# Altium project MAIN BOARD CERES.PrjPcb (part 1 of 2)
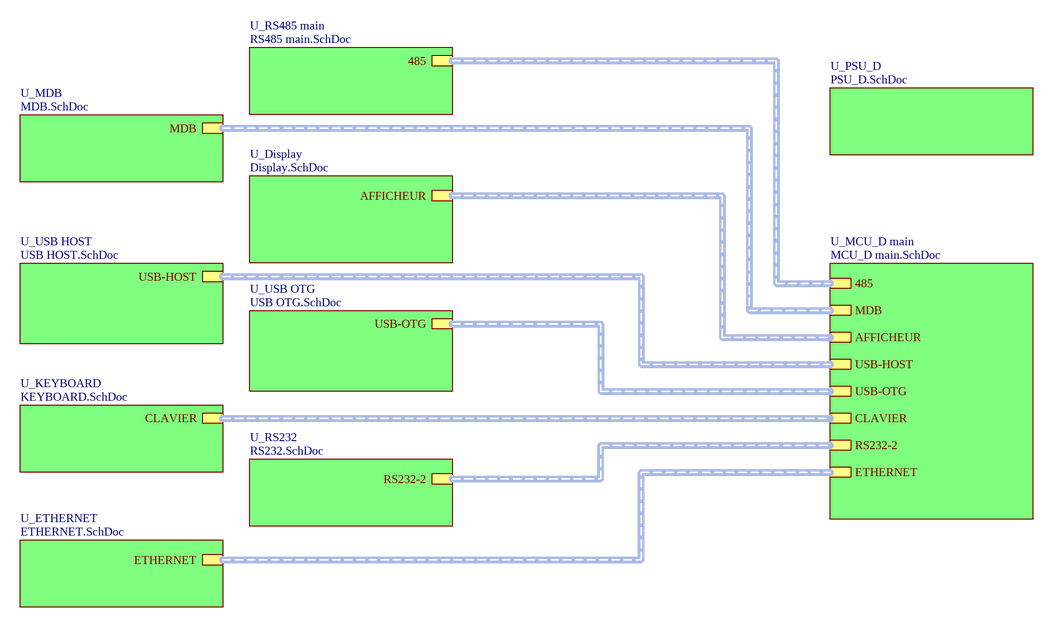
[diagram p0: TOPSHEET.SchDoc]
DrawnBy: Rachid AKKOUCHE; Telephone: +33651604047
10 sheets, 146 parts. Net scope: hierarchical (ports join the sheet entries above them; power ports are global).
Board file: MAIN BOARD CERESV2-2-3.PCBDOC
Sheets:
  TOPSHEET.SchDoc
    U_RS485 main = RS485 main.SchDoc
    U_MDB = MDB.SchDoc
    U_KEYBOARD = KEYBOARD.SchDoc
    U_USB HOST = USB HOST.SchDoc
    U_USB OTG = USB OTG.SchDoc
    U_Display = Display.SchDoc
    U_RS232 = RS232.SchDoc
    U_ETHERNET = ETHERNET.SchDoc
    U_PSU_D = PSU_D.SchDoc

## Sheet TOPSHEET.SchDoc: TOP SHEET
size A4; Date: 30 08 2013; Author: Rachid AKKOUCHE; CompanyName: RASoftware; Organization: RASoftware; Address1: 52 J03, rue de la crèche; Address2: 77100 MEAUX; Address3: FRANCE; DocumentNumber: BRA201308301C; Revision: C; SheetNumber: 1; SheetTotal: 11; Telephone: +33651604047; Email: rachid.akkouche@wanadoo.fr; Proprietaire: MDI; Dessinepar: Rachid AKKOUCHE; Verifiepar: -; Time: 19:00

### Sub-sheets
U_Display = Display.SchDoc: AFFICHEUR (harness IO DISPLAY)
U_ETHERNET = ETHERNET.SchDoc: ETHERNET (harness ETHERNET)
U_KEYBOARD = KEYBOARD.SchDoc: CLAVIER (harness KEYBOARD)
U_MCU_D main = MCU_D main.SchDoc (file not in this document): USB-HOST (harness USB-HOST), USB-OTG (harness USG-OTG), RS232-2 (harness RS232_2), ETHERNET (harness ETHERNET), AFFICHEUR (harness IO DISPLAY), CLAVIER (harness KEYBOARD), 485 (harness EIA-485), MDB (harness MDB)
U_MDB = MDB.SchDoc: MDB (harness MDB)
U_PSU_D = PSU_D.SchDoc: no entries
U_RS232 = RS232.SchDoc: RS232-2 (harness RS232_2)
U_RS485 main = RS485 main.SchDoc: 485 (harness EIA-485)
U_USB HOST = USB HOST.SchDoc: USB-HOST (harness USB-HOST)
U_USB OTG = USB OTG.SchDoc: USB-OTG (harness USG-OTG)

### Buses and harness runs
harness sheet U_Display/AFFICHEUR = sheet U_MCU_D main/AFFICHEUR
harness sheet U_ETHERNET/ETHERNET = sheet U_MCU_D main/ETHERNET
harness sheet U_KEYBOARD/CLAVIER = sheet U_MCU_D main/CLAVIER
harness sheet U_MCU_D main/485 = sheet U_RS485 main/485
harness sheet U_MCU_D main/MDB = sheet U_MDB/MDB
harness sheet U_MCU_D main/RS232-2 = sheet U_RS232/RS232-2
harness sheet U_MCU_D main/USB-HOST = sheet U_USB HOST/USB-HOST
harness sheet U_MCU_D main/USB-OTG = sheet U_USB OTG/USB-OTG

### Notes on the sheet
- Ce document est la propriété de
- Project:
- Il ne peut être divulgué sans l'accord écrit de l'un de ses représentants dûment mandaté
- Title:
- Number:
- Date:
- Time:
- Size:
- A4
- Revision:
- Sheet
- of
- 52 J03 rue de la crèche
- Draw by:
- 77100 Meaux

## Sheet RS485 main.SchDoc: RS 485
size A4; Date: 30 08 2013; Author: Rachid AKKOUCHE; CompanyName: RASoftware; DrawnBy: Rachid AKKOUCHE; Organization: RASoftware; Address1: 52 J03, rue de la crèche; Address2: 77100 MEAUX; Address3: FRANCE; DocumentNumber: BRA201308304C; Revision: C; SheetNumber: 4; SheetTotal: 11; Telephone: +33651604047; Email: rachid.akkouche@wanadoo.fr; Proprietaire: MDI System; Dessinepar: -; Verifiepar: -; Time: 19:00
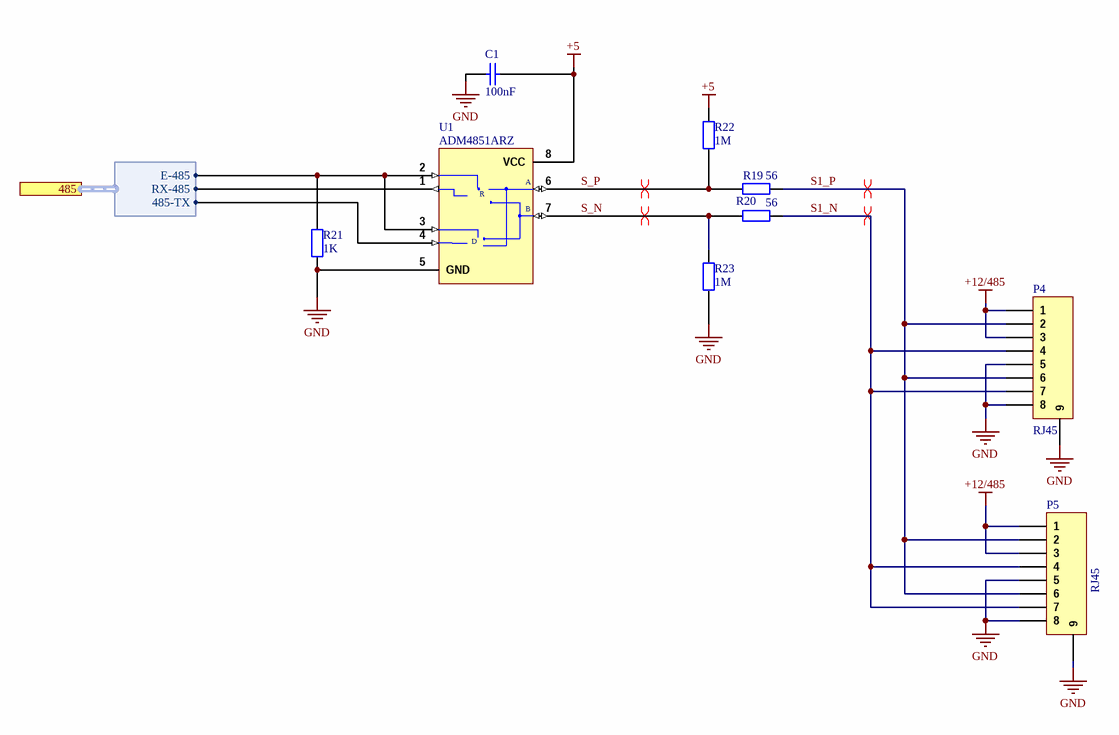
[diagram p1: RS485 main.SchDoc]

### Parts
C1  100nF  [C0805]
P4  RJ45  [MOLEX-RJ45_855135013]
P5  RJ45  [MOLEX-RJ45_855135013]
R19  56  [R0805]
R20  56  [R0805]
R21  1K  [R0805]
R22  1M  [R0805]
R23  1M  [R0805]
U1  ADM4851ARZ  [SOIC8]

### Ports
485 (harness EIA-485)

### Harnesses
EIA-485: 485-TX, RX-485, E-485

### Nets
+5: C1.1 R22.2 U1.8(VCC)
+12/485: P4.1 P4.3 P5.1 P5.3
GND: C1.2 P4.5 P4.8 P4.9 P5.5 P5.8 P5.9 R21.1 R23.1 U1.5(GND)
S1_N: P4.4 P4.7 P5.4 P5.7 R20.2  [project net S1_N_4]
S1_P: P4.2 P4.6 P5.2 P5.6 R19.2  [project net S1_P_4]
S_N: R20.1 R23.2 U1.7(B)  [project net S_N_4]
S_P: R19.1 R22.1 U1.6(A)  [project net S_P_4]
NetR21_2: R21.2 U1.2(~{RE}) U1.3(DE) ; port 485.E-485
NetU1_1: U1.1(RO) ; port 485.RX-485
NetU1_4: U1.4(DI) ; port 485.485-TX

### Layout directives
differential pair: S1_N_4, S1_P_4, S_N_4, S_P_4

### Notes on the sheet
- Ce document est la propriété de
- Project:
- Il ne peut être divulgué sans l'accord écrit de l'un de ses représentants dûment mandaté
- Title:
- Number:
- Date:
- Time:
- Size:
- A4
- Revision:
- Sheet
- of
- 52 J03 rue de la crèche
- Draw by:
- 77100 Meaux
- (in symbol MAX485ESA) R; D

### Library data of the parts
C1 = Cap 0805 100nF: Capacitor; Manufacturer: MULTICOMP; Manufacturer Part Number: MCCA000296; Supplier 1: Farnell; Supplier Part Number 1: 1759167; Pricing 1: 100=0,01, 500=0,008, 1000=0,006, 4000=0,005 (EUR); ComponentLink1URL: http://www.farnell.com/datasheets/1520827.pdf; ComponentLink1Description: http://www.farnell.com/datasheets/1520827.pdf
P4 P5 = Header 8: Header, 8-Pin; Manufacturer: MOLEX; Manufacturer Part Number: 85513-5013; Genre: Embase; Nombre de contacts: 8; Nombre de ports: 1; Catégorie LAN: Cat3; Terminaison du contact: Montage en surface vertical; Plaquage du contact: Or; Matériau du contact: Bronze phosphoreux; Approval Category: UL 94V-0; Couleur: Black; Courant: 1.5; Force diélectrique, Vca: 1000; Inflammabilité: UL94V-0; Largeur (externe): 15.9; Longueur/hauteur: 13; Matière: Glass Filled LCP; Profondeur: 18.8; Résistance d'isolement: 500; Résistance, contact: 20; Température de fonctionnement max..: 80; Température d'utilisation min: -40; Tension c.a.: 125; Supplier 1: Farnell; Supplier Part Number 1: 1345055; RoHS: YES; Pricing 1: 1=0,98, 10=0,92, 50=0,86, 100=0,74 (EUR); Type de connecteur: RJ45; Nombre de positions: 8; Body Plating: Or; Nombre de voies: 8; ComponentLink1URL: http://www.farnell.com/cad/1734187.pdf; ComponentLink1Description: http://www.farnell.com/cad/1734187.pdf; ComponentLink2URL: http://www.farnell.com/datasheets/1733622.pdf; ComponentLink2Description: http://www.farnell.com/datasheets/1733622.pdf
R19 R20 = Resistor 0805 56: Resistor; Manufacturer: MULTICOMP; Manufacturer Part Number: MC01W0805156R; Product Range: MULTICOMP - MC Series; Puissance: 100; Tolérance de résistance: ± 1%; Type de boîtier de résistance: 0805; Type de résistance: Couche épaisse; Coefficient de température: ± 200; Tension: 150; Type de packaging: Full Reel; SVHC: No SVHC (20-Jun-2013); Resistor Mounting: CMS; Supplier 1: Farnell; RoHS: YES; Pricing 1: 5000=0,001 (EUR); Résistance: 56; MSL: (Non Applicable); ComponentLink1URL: http://www.farnell.com/datasheets/1729047.pdf; ComponentLink1Description: http://www.farnell.com/datasheets/1729047.pdf; Supplier Part Number 1: 2129016
R21 = Resistor 0805 1K: Resistor; Manufacturer: MULTICOMP; Manufacturer Part Number: MC0.1W08051%1KFR; Product Range: MULTICOMP - MC Series; Résistance: 1; Puissance: 100; Tolérance de résistance: ± 1%; Type de boîtier de résistance: 0805; Type de résistance: Couche épaisse; Coefficient de température: ± 100; Tension: 150; Type de packaging: Full Reel; Resistor Mounting: CMS; Supplier 1: Farnell; RoHS: YES; Pricing 1: 5000=0,001 (EUR); MSL: MSL 1 - Illimité; ComponentLink1URL: http://www.farnell.com/datasheets/1716700.pdf; ComponentLink1Description: http://www.farnell.com/datasheets/1716700.pdf; Supplier Part Number 1: 2129113
R22 R23 = Resistor 0805 680: Resistor; Manufacturer: MULTICOMP; Manufacturer Part Number: MC01W080511M; Supplier 1: Farnell; Supplier Part Number 1: 2129354; RoHS: Y-EX; Pricing 1: 5000=0.003, 25000=0.002, 50000=0.0018 (GBP); ComponentLink1URL: http://www.farnell.com/datasheets/1729047.pdf; ComponentLink1Description: http://www.farnell.com/datasheets/1729047.pdf; ComponentLink2URL: http://www.farnell.com/datasheets/1944283.pdf; ComponentLink2Description: http://www.farnell.com/datasheets/1944283.pdf
U1 = MAX485ESA: Low-Power, Slew-Rate-Limited RS-485/RS-422 Transceiver; Manufacturer: ANALOG DEVICES; Type de driver: Émetteur-récepteur de ligne différentiel; Type d'interface CI: RS422, RS485; Nombre de drivers: 1; Tension, alimentation min.: 4.75; Tension, alimentation max..: 5.25; Type de boîtier CI Driver: NSOIC; Nombre de broches: 8; Température d'utilisation min: -40; Température de fonctionnement max..: 85; SVHC: No SVHC (20-Jun-2013); Supplier 1: Farnell; Supplier Part Number 1: 2313594; Manufacturer Part Number: ADM4851ARZ; RoHS: YES; Pricing 1: 1=1,39, 10=1,13, 100=1,01, 250=0,9, 500=0,79 (EUR); MSL: MSL 1 - Illimité; ComponentLink1URL: http://www.analog.com/static/imported-files/data_sheets/ADM4850_4851_4852_4853_4854_4855_4856_4857.pdf; ComponentLink1Description: http://www.analog.com/static/imported-files/data_sheets/ADM4850_4851_4852_4853_4854_4855_4856_4857.pdf; ComponentLink2URL: http://www.farnell.com/cad/1713403.zip; ComponentLink2Description: http://www.farnell.com/cad/1713403.zip

## Sheet MDB.SchDoc: MDB
size A4; Date: 30 08 2013; Author: Rachid AKKOUCHE; CompanyName: RASoftware; DrawnBy: Rachid AKKOUCHE; Organization: RASoftware; Address1: 52 J03, rue de la crèche; Address2: 77100 MEAUX; Address3: FRANCE; DocumentNumber: BRA201308303C; Revision: C; SheetNumber: 3; SheetTotal: 11; Telephone: +33651604047; Email: rachid.akkouche@wanadoo.fr; Proprietaire: MDI System; Dessinepar: -; Verifiepar: -; Time: 19:00
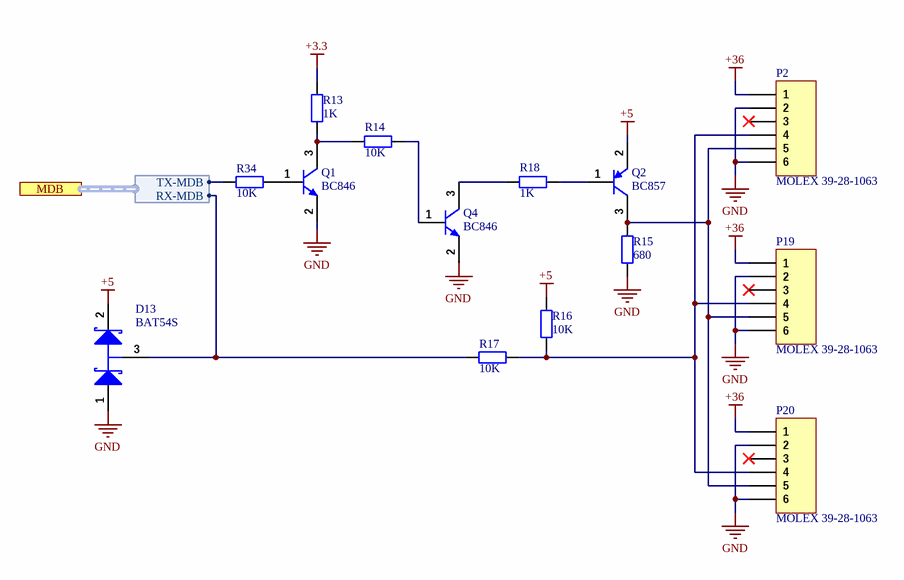
[diagram p2: MDB.SchDoc]

### Parts
D13  BAT54S  [SOT23]
P2  MOLEX 39-28-1063  [MOLEX 39-28-1063]
P19  MOLEX 39-28-1063  [MOLEX 39-28-1063]
P20  MOLEX 39-28-1063  [MOLEX 39-28-1063]
Q1  BC846  [SOT-23]
Q2  BC857  [SOT-23]
Q4  BC846  [SOT-23]
R13  1K  [R0805]
R14  10K  [R0805]
R15  680  [R0805]
R16  10K  [R0805]
R17  10K  [R0805]
R18  1K  [R0805]
R34  10K  [R0805]

### Ports
MDB (harness MDB)

### Harnesses
MDB: TX-MDB, RX-MDB

### Nets
+3.3: R13.2
+5: D13.2(K) Q2.2(E) R16.2
+36: P2.1 P19.1 P20.1
GND: D13.1(A) P2.2 P2.6 P19.2 P19.6 P20.2 P20.6 Q1.2(E) Q4.2(E) R15.1
NetD13_3: D13.3(C) R17.2 ; port MDB.RX-MDB
NetP2_4: P2.4 P19.4 P20.4 R16.1 R17.1
NetP2_5: P2.5 P19.5 P20.5 Q2.3(C) R15.2
NetQ1_1: Q1.1(B) R34.1
NetQ1_3: Q1.3(C) R13.1 R14.2
NetQ2_1: Q2.1(B) R18.1
NetQ4_1: Q4.1(B) R14.1
NetQ4_3: Q4.3(C) R18.2
NetR34_2: R34.2 ; port MDB.TX-MDB

Not connected (* = marked no-connect by the designer): P2 3*; P19 3*; P20 3*

### Notes on the sheet
- Ce document est la propriété de
- Project:
- Il ne peut être divulgué sans l'accord écrit de l'un de ses représentants dûment mandaté
- Title:
- Number:
- Date:
- Time:
- Size:
- A4
- Revision:
- Sheet
- of
- 52 J03 rue de la crèche
- Draw by:
- 77100 Meaux

### Library data of the parts
D13 = BAT54S: Schottky Barrier Double Diode; Manufacturer: MULTICOMP; Courant, If moy.: 200; Tension, Vrrm: 30; Tension, Vf max..: 400; Temps trr max.: 5; Courant, Ifs max.: 600; Type de boîtier diode: SOT-23; Nombre de broches: 3; SVHC: No SVHC (19-Dec-2012); Configuration diode: Dual Series; Température, Tj max..: 150; Type de terminaison: SMD; Température d'utilisation min: -55; Courant, If, Vf: 10; Courant, Ir, max..: 2; Marquage, CMS: L44; Température de fonctionnement: -55°C à +150; Supplier 1: Farnell; Supplier Part Number 1: 1621835; Manufacturer Part Number: BAT54S; RoHS: YES; Stock 1: 52055; Pricing 1: 10=0,102, 250=0,074, 1000=0,06, 3000=0,053 (EUR); Diode Type: Schottky; Type de boîtier: SOT-23; courant Ifsm: 600; ComponentLink1URL: http://www.farnell.com/datasheets/1317753.pdf; ComponentLink1Description: http://www.farnell.com/datasheets/1317753.pdf; Température de fonctionnement max..: 150
P2 P19 P20 = Header 6: Connecteur MDB; Supplier 1: Farnell; Supplier Part Number 1: 9732101; Manufacturer: MOLEX; Manufacturer Part Number: 39-28-1063; RoHS: YES; Pricing 1: 1=0,66, 100=0,62, 250=0,58, 500=0,52, 1000=0,46 (EUR); ComponentLink1URL: http://www.molex.com/pdm_docs/sd/039310028_sd.pdf; ComponentLink1Description: http://www.molex.com/pdm_docs/sd/039310028_sd.pdf; ComponentLink2URL: http://www.youtube.com/watch?v=pjOsgpqyzYE; ComponentLink2Description: http://www.youtube.com/watch?v=pjOsgpqyzYE; ComponentLink3URL: http://www.farnell.com/datasheets/1729684.pdf; ComponentLink3Description: http://www.farnell.com/datasheets/1729684.pdf
Q1 Q4 = BC846B: NPN General-purpose Transistor; Manufacturer: NXP; Tension, Vceo: 65; Dissipation de puissance Pd: 250; Courant de collecteur DC: 100; Gain en courant DC hFE: 110; Température d'utilisation min: -65; Température de fonctionnement max..: 150; Nombre de broches: 3; SVHC: No SVHC (19-Dec-2012); Courant, Ic (hfe): 2; FB max..: 10; Gain Bande-passante ft, typ.: 300; Hfe, typ.: 125; Marquage, CMS: 1; Température de fonctionnement: -65°C à +150; Tension, Vcbo: 80; Tension, Vce sat max..: 200; Type de terminaison: SMD; Supplier 1: Farnell; Supplier Part Number 1: 1081227; Manufacturer Part Number: BC846; RoHS: YES; Pricing 1: 10=0,02, 100=0,016, 1000=0,015, 3000=0,013 (EUR); Polarité transistor: NPN; Type de boîtier de transistor: SOT-23; Courant Ic max..: 100; Courant, Ic max.. permanent a: 100; Hfe, min.: 110; Marquage composant: BC846; Nombre de transistors: 1; Puissance, Ptot: 250; Type de boîtier: SOT-23; ft, min.: 100; ComponentLink1URL: http://www.farnell.com/datasheets/1581369.pdf; ComponentLink1Description: http://www.farnell.com/datasheets/1581369.pdf
Q2 = PMBT2907A: PNP Switching Transistor; Manufacturer: NXP; Supplier 1: Farnell; Supplier Part Number 1: 1081244; Manufacturer Part Number: BC857; RoHS: YES; Stock 1: 28017; Pricing 1: 10=0,023, 100=0,021, 1000=0,019, 3000=0,017 (EUR); ComponentLink1URL: http://www.nxp.com/documents/data_sheet/BC856_BC857_BC858.pdf; ComponentLink1Description: http://www.nxp.com/documents/data_sheet/BC856_BC857_BC858.pdf
R13 R18 = Resistor 0805 1K: as R21 on sheet RS485 main; Supplier 1: Farnell; RoHS: YES; Pricing 1: 5000=0,001 (EUR); MSL: MSL 1 - Illimité; ComponentLink1URL: http://www.farnell.com/datasheets/1716700.pdf; ComponentLink1Description: http://www.farnell.com/datasheets/1716700.pdf; Supplier Part Number 1: 2129113
R14 R17 R34 = Resistor 0805 10K: Resistor; Manufacturer: MULTICOMP; Manufacturer Part Number: MC0.1W08051%10KFR; Product Range: MULTICOMP - MC Series; Résistance: 10; Puissance: 100; Tolérance de résistance: ± 1%; Type de boîtier de résistance: 0805; Type de résistance: Couche épaisse; Coefficient de température: ± 100; Tension: 150; Type de packaging: Full Reel; Resistor Mounting: CMS; Supplier 1: Farnell; RoHS: YES; Pricing 1: 5000=0,001 (EUR); MSL: MSL 1 - Illimité; ComponentLink1URL: http://www.farnell.com/datasheets/1716700.pdf; ComponentLink1Description: http://www.farnell.com/datasheets/1716700.pdf; Supplier Part Number 1: 2129195
R15 = Resistor 0805 680: Resistor; Manufacturer: MULTICOMP; Manufacturer Part Number: MC01W08051680R; Supplier 1: Farnell; RoHS: YES; Pricing 1: 5000=0,001 (EUR); ComponentLink1URL: http://www.farnell.com/datasheets/1729047.pdf; ComponentLink1Description: http://www.farnell.com/datasheets/1729047.pdf; Supplier Part Number 1: 2129101
R16 = Resistor 0805 390: Resistor; Manufacturer: MULTICOMP; Manufacturer Part Number: MC01W0805110K; Gamme de produit: Série MC; Résistance: 10; Puissance: 100; Tolérance de résistance: ± 1%; Tension: 150; Type de boîtier de résistance: 0805 [2012 Metric]; Type de packaging: Bande et Bobine; Type de résistance: Couche épaisse; Coefficient de température: ± 100; SVHC: No SVHC (17-Dec-2014); Montage de résistance: CMS; Quantité par bobine: 5000; Supplier 1: Farnell; Supplier Part Number 1: 2129195; RoHS: YES; Stock 1: 3894995; Pricing 1: 5000=0,0008 (EUR); MSL: -; ComponentLink1URL: http://www.farnell.com/datasheets/1729047.pdf; ComponentLink1Description: http://www.farnell.com/datasheets/1729047.pdf

## Sheet KEYBOARD.SchDoc: KEYBOARD
size A4; Date: 30 08 2013; Author: Rachid AKKOUCHE; CompanyName: RASoftware; DrawnBy: Rachid AKKOUCHE; Organization: RASoftware; Address1: 52 J03, rue de la crèche; Address2: 77100 MEAUX; Address3: FRANCE; DocumentNumber: BRA201308306C; Revision: C; SheetNumber: 6; SheetTotal: 11; Telephone: +33651604047; Email: rachid.akkouche@wanadoo.fr; Proprietaire: MDI System; Dessinepar: -; Verifiepar: -; Time: 19:00
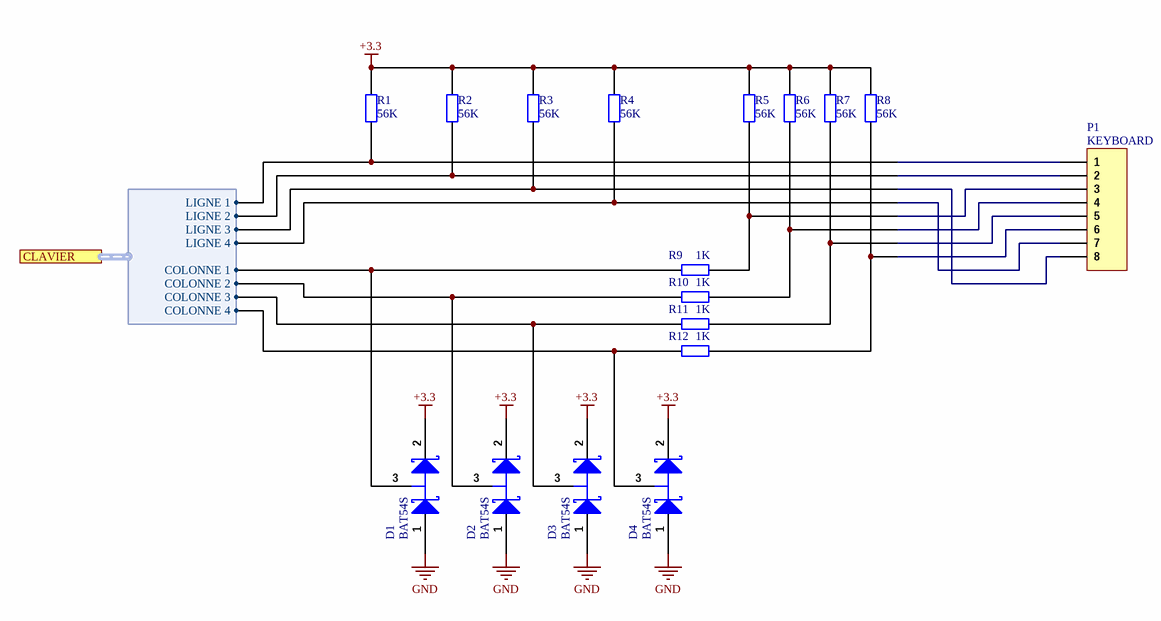
[diagram p3: KEYBOARD.SchDoc]

### Parts
D1  BAT54S  [SOT-23]
D2  BAT54S  [SOT-23]
D3  BAT54S  [SOT-23]
D4  BAT54S  [SOT-23]
P1  KEYBOARD  [M20_1X8]
R1  56K  [R0805]
R2  56K  [R0805]
R3  56K  [R0805]
R4  56K  [R0805]
R5  56K  [R0805]
R6  56K  [R0805]
R7  56K  [R0805]
R8  56K  [R0805]
R9  1K  [R0805]
R10  1K  [R0805]
R11  1K  [R0805]
R12  1K  [R0805]

### Ports
CLAVIER (harness KEYBOARD)

### Harnesses
KEYBOARD: COLONNE 1, COLONNE 2, COLONNE 3, COLONNE 4, LIGNE 1, LIGNE 2, LIGNE 3, LIGNE 4

### Nets
+3.3: D1.2(K) D2.2(K) D3.2(K) D4.2(K) R1.1 R2.1 R3.1 R4.1 R5.1 R6.1 R7.1 R8.1
GND: D1.1(A) D2.1(A) D3.1(A) D4.1(A)
NetD1_3: D1.3(C) R9.1 ; port CLAVIER.COLONNE 1
NetD2_3: D2.3(C) R10.1 ; port CLAVIER.COLONNE 2
NetD3_3: D3.3(C) R11.1 ; port CLAVIER.COLONNE 3
NetD4_3: D4.3(C) R12.1 ; port CLAVIER.COLONNE 4
NetP1_1: P1.1 R1.2 ; port CLAVIER.LIGNE 1
NetP1_2: P1.2 R2.2 ; port CLAVIER.LIGNE 2
NetP1_3: P1.3 R5.2 R9.2
NetP1_4: P1.4 R6.2 R10.2
NetP1_5: P1.5 R7.2 R11.2
NetP1_6: P1.6 R8.2 R12.2
NetP1_7: P1.7 R4.2 ; port CLAVIER.LIGNE 4
NetP1_8: P1.8 R3.2 ; port CLAVIER.LIGNE 3

### Notes on the sheet
- Ce document est la propriété de
- Project:
- Il ne peut être divulgué sans l'accord écrit de l'un de ses représentants dûment mandaté
- Title:
- Number:
- Date:
- Time:
- Size:
- A4
- Revision:
- Sheet
- of
- 52 J03 rue de la crèche
- Draw by:
- 77100 Meaux

### Library data of the parts
D1-D4 = BAT54S: Schottky Barrier Double Diode; Manufacturer: MULTICOMP; Published: 17-Sep-2003; LatestRevisionDate: 12-Dec-2006; LatestRevisionNote: IPC-7351 Footprint Added.; DatasheetVersion: 4-Mar-2002; PackageVersion: May-1999; PackageReference: SOT23; Publisher: Altium Limited; PackageDescription: 3-Pin SOT-23 Package 0.95 mm Pitch, 2.3 mm Lead Span; ComponentLink1Description: Manufacturer Link; ComponentLink1URL: http://www.semiconductors.philips.com/; ComponentLink2Description: Datasheet; ComponentLink2URL: http://www.semiconductors.philips.com/acrobat/datasheets/BAT54_SERIES_4.pdf; Supplier 1: Farnell; Supplier Part Number 1: 1621835; Manufacturer Part Number: BAT54S; RoHS: YES; Stock 1: 51548; Pricing 1: 10=0,102, 250=0,074, 1000=0,06, 3000=0,053 (EUR); ComponentLink3URL: http://www.farnell.com/datasheets/1317753.pdf; ComponentLink3Description: http://www.farnell.com/datasheets/1317753.pdf
P1 = Header 8: Header, 8-Pin; Manufacturer: HARWIN; Manufacturer Part Number: M20-8770842; LatestRevisionDate: 17-Jul-2002; LatestRevisionNote: Re-released for DXP Platform.; Publisher: Altium Limited; Supplier 1: Farnell; Supplier Part Number 1: 1517385; RoHS: YES; Pricing 1: 10=0,9, 20=0,86, 50=0,8, 100=0,77, 250=0,75, 500=0,71 (EUR); ComponentLink1URL: http://www.farnell.com/datasheets/1089525.pdf; ComponentLink1Description: http://www.farnell.com/datasheets/1089525.pdf; ComponentLink2URL: http://www.farnell.com/datasheets/5481.pdf; ComponentLink2Description: http://www.farnell.com/datasheets/5481.pdf
R1-R8 = Resistor 0805 56K: Resistor; Manufacturer: MULTICOMP; Manufacturer Part Number: MC0.1W08051%56KFR; Product Range: MULTICOMP - MC Series; Résistance: 56; Puissance: 100; Tolérance de résistance: ± 1%; Type de boîtier de résistance: 0805; Type de résistance: Couche épaisse; Coefficient de température: ± 100; Tension: 150; Type de packaging: Full Reel; Resistor Mounting: CMS; Resistor Terminals: (Non Disponible); Supplier 1: Farnell; RoHS: YES; Pricing 1: 5000=0,001 (EUR); MSL: (Non Applicable); ComponentLink1URL: http://www.farnell.com/datasheets/1716700.pdf; ComponentLink1Description: http://www.farnell.com/datasheets/1716700.pdf; Supplier Part Number 1: 2129258
R9-R12 = Res2: Resistor; Manufacturer: MULTICOMP; Manufacturer Part Number: MC0.1W08051%1KFR; Product Range: MULTICOMP - MC Series; Résistance: 1; Puissance: 100; Tolérance de résistance: ± 1%; Type de boîtier de résistance: 0805; Type de résistance: Couche épaisse; Coefficient de température: ± 100; Tension: 150; Type de packaging: Full Reel; Resistor Mounting: CMS; Supplier 1: Farnell; Supplier Part Number 1: 2129113; RoHS: YES; Pricing 1: 5000=0,001 (EUR); MSL: MSL 1 - Illimité; ComponentLink1URL: http://www.farnell.com/datasheets/1636796.pdf; ComponentLink1Description: http://www.farnell.com/datasheets/1636796.pdf

## Sheet USB HOST.SchDoc: USB HOST
size A4; Date: 30 08 2013; Author: Rachid AKKOUCHE; CompanyName: RASoftware; DrawnBy: Rachid AKKOUCHE; Engineer: Rachid AKKOUCHE; Organization: RASoftware; Address1: 52 J03, rue de la crèche; Address2: 77100 MEAUX; Address3: FRANCE; DocumentNumber: BRA201308309C; Revision: C; SheetNumber: 9; SheetTotal: 11; Telephone: +33651604047; Email: rachid.akkouche@wanadoo.fr; Proprietaire: MDI System; Dessinepar: -; Verifiepar: -; Time: 19:00
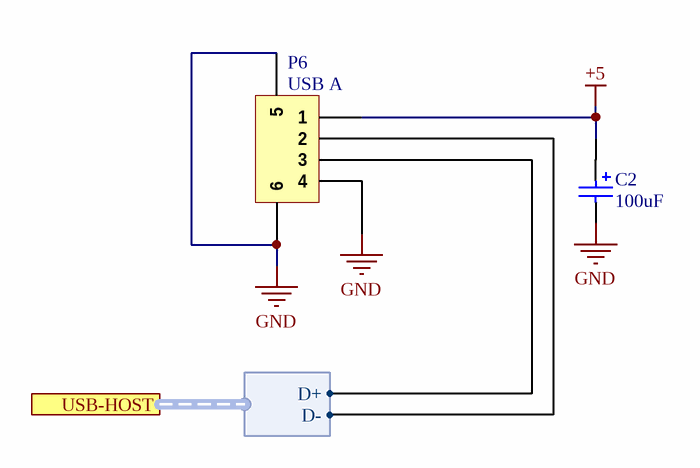
[diagram p4: USB HOST.SchDoc]

### Parts
C2  100uF  [Kemet_63]
P6  USB A  [USB  2410 06]

### Ports
USB-HOST (harness USB-HOST)

### Harnesses
USB-HOST: D-, D+

### Nets
+5: C2.1 P6.1
GND: C2.2 P6.4 P6.5 P6.6
NetP6_2: P6.2 ; port USB-HOST.D-
NetP6_3: P6.3 ; port USB-HOST.D+

### Notes on the sheet
- Ce document est la propriété de
- Project:
- Il ne peut être divulgué sans l'accord écrit de l'un de ses représentants dûment mandaté
- Title:
- Number:
- Date:
- Time:
- Size:
- A4
- Revision:
- Sheet
- of
- 52 J03 rue de la crèche
- Draw by:
- 77100 Meaux

### Library data of the parts
C2 = Cap Pol 100uF: Polarized Capacitor; Manufacturer: EPCOS; Manufacturer Part Number: B41142A4107M; Product Range: EPCOS - B41142 Series; Capacité: 100; Tolérance de capacité: ± 20%; Tension: 16; Type de boîtier de condensateur: Radial Can - SMD; Diamètre: 6.3; Résistance, ESR: 0.16; Hauteur: 7.7; Courant d'ondulation c.a.: 300; Type de packaging: Cut Tape; Durée de vie @ température: 2000 heures @ 105; Température d'utilisation min: -55; Température de fonctionnement max..: 105; SVHC: No SVHC (19-Dec-2012); Impédance: 0.26; Température de fonctionnement: -55°C à +105; Température, ESR: 20; Type de boîtier: CMS; Supplier 1: Farnell; RoHS: YES; Pricing 1: 10=0,123, 50=0,095, 100=0,078, 250=0,07, 1000=0,062 (EUR); Courant d'ondulation c.a. à  100Hz: 300; Fréquence, impédance: 100; Longueur/hauteur: 7.7; Température, courant ondulatoire: 105; Température, impédance: 20; ComponentLink1URL: http://www.epcos.com/inf/20/30/db/alu_x/B41142.pdf; ComponentLink1Description: http://www.epcos.com/inf/20/30/db/alu_x/B41142.pdf; Supplier Part Number 1: 1735328
P6 = Header 4_1: USB 2.0 Connector A; Manufacturer: LUMBERG; Manufacturer Part Number: 2410 06; Type de connecteur: USB Type A; Série: 2410; Genre: Embase; Nombre de contacts: 4; Terminaison du contact: A souder; Montage connecteur: CI; Plaquage du contact: Or; Matériau du contact: Cuivre; SVHC: No SVHC (19-Dec-2012); Body Plating: Etain; Courant: 1; Montage, orientation: 90°; Nombre de cycles d'accouplements: 1500; Plaquage borne: Tin; Résistance, contact: 30; Température de fonctionnement max..: +105; Température d'utilisation min: -55; Tension, vérification: 750; Type de montage: Montage en surface; Supplier 1: Farnell; Supplier Part Number 1: 1308874; RoHS: YES; Pricing 1: 1=0,63, 10=0,53, 50=0,51, 100=0,48 (EUR); Contact Material: CuSn; Tension c.a.: 30; ComponentLink1URL: http://www.farnell.com/datasheets/1715380.pdf; ComponentLink1Description: http://www.farnell.com/datasheets/1715380.pdf

## Sheet USB OTG.SchDoc: USG OTG
size A4; Date: 30 08 2013; Author: Rachid AKKOUCHE; CompanyName: RASoftware; DrawnBy: Rachid AKKOUCHE; Engineer: Rachid AKKOUCHE; Organization: RASoftware; Address1: 52 J03, rue de la crèche; Address2: 77100 MEAUX; Address3: FRANCE; DocumentNumber: BRA2013083010C; Revision: C; SheetNumber: 10; SheetTotal: 11; Telephone: +33651604047; Email: rachid.akkouche@wanadoo.fr; Proprietaire: MDI System; Dessinepar: -; Verifiepar: -; Time: 19:30
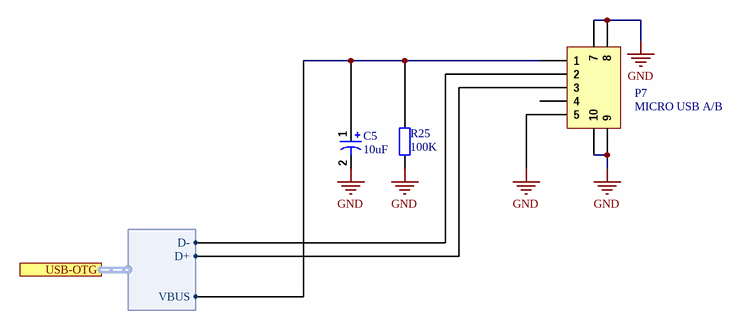
[diagram p5: USB OTG.SchDoc]

### Parts
C5  10uF  [KEMET_4]  (no BOM)
P7  MICRO USB A/B  [USB FCI 10104111]  (no BOM)
R25  100K  [R0805]

### Ports
USB-OTG (harness USG-OTG)

### Harnesses
USG-OTG: D-, D+, VBUS

### Nets
GND: C5.2 P7.5 P7.7 P7.8 P7.9 P7.10 R25.1
NetC5_1: C5.1 P7.1 R25.2 ; port USB-OTG.VBUS
NetP7_2: P7.2 ; port USB-OTG.D-
NetP7_3: P7.3 ; port USB-OTG.D+

Not connected (* = marked no-connect by the designer): P7 4

### Notes on the sheet
- Ce document est la propriété de
- Project:
- Il ne peut être divulgué sans l'accord écrit de l'un de ses représentants dûment mandaté
- Title:
- Number:
- Date:
- Time:
- Size:
- A4
- Revision:
- Sheet
- of
- 52 J03 rue de la crèche
- Draw by:
- 77100 Meaux

### Library data of the parts
C5 = Cap Pol1: Polarized Capacitor; Manufacturer: KEMET; Manufacturer Part Number: EXV106M025A9BAA; Supplier 1: Farnell; Supplier Part Number 1: 2069174; RoHS: YES; Pricing 1: 10=0,111, 100=0,085, 500=0,074, 1000=0,07, 5000=0,066 (EUR); ComponentLink1URL: http://www.farnell.com/datasheets/1500293.pdf; ComponentLink1Description: http://www.farnell.com/datasheets/1500293.pdf
P7 = Header 5: Header, 5-Pin; Manufacturer: FCI; Manufacturer Part Number: 10104111-0001LF; Type de connecteur: USB Micro A/B; Série: 10104111; Genre: Embase; Nombre de contacts: 5; Terminaison du contact: Montage en surface à angle droit; Montage connecteur: CI; Plaquage du contact: Or; Matériau du contact: Cuivre; SVHC: No SVHC (20-Jun-2013); LatestRevisionDate: 17-Jul-2002; LatestRevisionNote: Re-released for DXP Platform.; Publisher: Altium Limited; Supplier 1: Farnell; Supplier Part Number 1: 2293755; RoHS: YES; Pricing 1: 1=0,98, 10=0,84, 25=0,76, 50=0,67, 100=0,64, 250=0,57 (EUR); ComponentLink1URL: http://portal.fciconnect.com/Comergent//fci/drawing/10104111.pdf; ComponentLink1Description: http://portal.fciconnect.com/Comergent//fci/drawing/10104111.pdf
R25 = Resistor 0805 100K: Resistor; Manufacturer: MULTICOMP; Manufacturer Part Number: MC0.1W08051%100KFR; Product Range: MULTICOMP - MC Series; Résistance: 100; Tolérance de résistance: ± 1%; Type de boîtier de résistance: 0805; Type de résistance: Couche épaisse; Coefficient de température: ± 100; Tension: 150; Type de packaging: Full Reel; Resistor Mounting: CMS; Supplier 1: Farnell; Supplier Part Number 1: 2129276; RoHS: YES; Pricing 1: 5000=0,001 (EUR); Puissance: 100; MSL: MSL 1 - Illimité; ComponentLink1URL: http://www.farnell.com/datasheets/1716700.pdf; ComponentLink1Description: http://www.farnell.com/datasheets/1716700.pdf

## Sheet Display.SchDoc: DISPLAY
size A4; Date: 30 08 2013; Author: Rachid AKKOUCHE; CompanyName: RASoftware; DrawnBy: Rachid AKKOUCHE; Engineer: Rachid AKKOUCHE; Organization: RASoftware; Address1: 52 J03, rue de la crèche; Address2: 77100 MEAUX; Address3: FRANCE; DocumentNumber: BRA201308307C; Revision: C; SheetNumber: 7; SheetTotal: 11; Telephone: +33651604047; Email: rachid.akkouche@wanadoo.fr; Proprietaire: MDI System; Dessinepar: -; Verifiepar: -; PageSetup: Record=PageOptions|CenterHorizontal=True|CenterVertical=True|PrintScale=1.00|XCorrection=1.00|YCorrection=1.00|PrintKind=1|BorderSize=5000000|LeftOffset=0|BottomOffset=0|Orientation=2|PaperLength=1000|PaperWidth=1000|Scale=100|PaperSource=1|PrintQuality=-3|MediaType=1|DitherType=10|PrintScaleMode=1|PaperKind=16K|PaperIndex=409; Time: 19:00
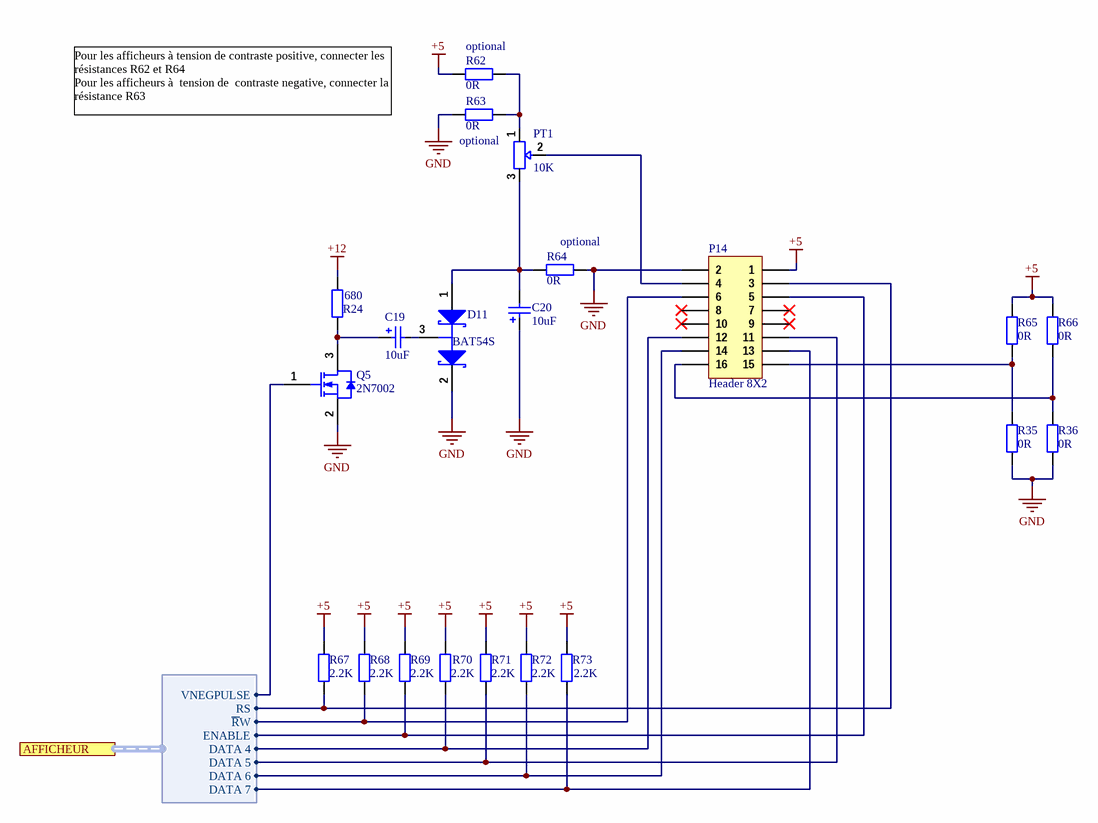
[diagram p6: Display.SchDoc]

### Parts
C19  10uF  [KEMET_4]
C20  10uF  [KEMET_4]
D11  BAT54S  [SOT-23]
P14  Header 8X2  [M20-2X8]
PT1  10K  [3361P]
Q5  2N7002  [SOT23]
R24  680  [R0805]
R35  0R  [R0805]
R36  0R  [R0805]
R62  0R  [R0805]
R63  0R  [R0805]
R64  0R  [R0805]
R65  0R  [R0805]
R66  0R  [R0805]
R67  2.2K  [R0805]
R68  2.2K  [R0805]
R69  2.2K  [R0805]
R70  2.2K  [R0805]
R71  2.2K  [R0805]
R72  2.2K  [R0805]
R73  2.2K  [R0805]

### Ports
AFFICHEUR (harness IO DISPLAY)

### Harnesses
IO DISPLAY: DATA 4, DATA 5, DATA 6, DATA 7, ENABLE, ~{R}W, RS, VNEGPULSE

### Nets
+5: P14.1 R62.2 R65.2 R66.2 R67.2 R68.2 R69.2 R70.2 R71.2 R72.2 R73.2
+12: R24.2
GND: C20.1 D11.2(K) P14.2 Q5.2(S) R35.1 R36.1 R63.2 R64.1
NetC19_1: C19.1 Q5.3(D) R24.1
NetC19_2: C19.2 D11.3(C)
NetC20_2: C20.2 D11.1(A) PT1.3 R64.2
NetP14_3: P14.3 R67.1 ; port AFFICHEUR.RS
NetP14_4: P14.4 PT1.2
NetP14_5: P14.5 R69.1 ; port AFFICHEUR.ENABLE
NetP14_6: P14.6 R68.1 ; port AFFICHEUR.~{R}W
NetP14_11: P14.11 R71.1 ; port AFFICHEUR.DATA 5
NetP14_12: P14.12 R70.1 ; port AFFICHEUR.DATA 4
NetP14_13: P14.13 R73.1 ; port AFFICHEUR.DATA 7
NetP14_14: P14.14 R72.1 ; port AFFICHEUR.DATA 6
NetP14_15: P14.15 R35.2 R65.1
NetP14_16: P14.16 R36.2 R66.1
NetPT1_1: PT1.1 R62.1 R63.1
NetQ5_1: Q5.1(G) ; port AFFICHEUR.VNEGPULSE

Not connected (* = marked no-connect by the designer): P14 7* 8* 9* 10*

### Notes on the sheet
- (near R62) optional
- Pour les afficheurs à tension de contraste positive, connecter les résistances R62 et R64
  Pour les afficheurs à  tension de  contraste negative, connecter la résistance R63
- optional
- (near R64) optional
- Ce document est la propriété de
- Project:
- Il ne peut être divulgué sans l'accord écrit de l'un de ses représentants dûment mandaté
- Title:
- Number:
- Date:
- Time:
- Size:
- A4
- Revision:
- Sheet
- of
- 52 J03 rue de la crèche
- Draw by:
- 77100 Meaux

### Library data of the parts
C19 C20 = Cap Pol 10uF: Polarized Capacitor; Manufacturer: KEMET; Manufacturer Part Number: EXV106M025A9BAA; Supplier 1: Farnell; Supplier Part Number 1: 2069174; RoHS: YES; Pricing 1: 10=0,111, 100=0,085, 500=0,074, 1000=0,07, 5000=0,066 (EUR); ComponentLink1URL: http://www.farnell.com/datasheets/1500293.pdf; ComponentLink1Description: http://www.farnell.com/datasheets/1500293.pdf
D11 = BAT54S: as D1 on sheet KEYBOARD; Published: 17-Sep-2003; LatestRevisionDate: 12-Dec-2006; LatestRevisionNote: IPC-7351 Footprint Added.; DatasheetVersion: 4-Mar-2002; PackageVersion: May-1999; PackageReference: SOT23; Publisher: Altium Limited; PackageDescription: 3-Pin SOT-23 Package 0.95 mm Pitch, 2.3 mm Lead Span; ComponentLink1Description: Manufacturer Link; ComponentLink1URL: http://www.semiconductors.philips.com/; ComponentLink2Description: Datasheet; ComponentLink2URL: http://www.semiconductors.philips.com/acrobat/datasheets/BAT54_SERIES_4.pdf; Supplier 1: Farnell; Supplier Part Number 1: 1621835; Manufacturer Part Number: BAT54S; RoHS: YES; Stock 1: 51548; Pricing 1: 10=0,102, 250=0,074, 1000=0,06, 3000=0,053 (EUR); ComponentLink3URL: http://www.farnell.com/datasheets/1317753.pdf; ComponentLink3Description: http://www.farnell.com/datasheets/1317753.pdf
P14 = Header 8X2: Header, 8-Pin, Dual row; Manufacturer: HARWIN; Manufacturer Part Number: M20-8760842; LatestRevisionDate: 17-Jul-2002; LatestRevisionNote: Re-released for DXP Platform.; Publisher: Altium Limited; Supplier 1: Farnell; Supplier Part Number 1: 1517392; RoHS: YES; Pricing 1: 10=1,4, 20=1,39, 50=1,38, 100=1,37, 250=1,33, 500=1,26 (EUR); ComponentLink1URL: http://www.farnell.com/datasheets/1089519.pdf; ComponentLink1Description: http://www.farnell.com/datasheets/1089519.pdf; ComponentLink2URL: http://www.farnell.com/datasheets/5481.pdf; ComponentLink2Description: http://www.farnell.com/datasheets/5481.pdf
PT1 = RV: Manufacturer: BOURNS; Manufacturer Part Number: 3361P-1-103GLF; Supplier 1: Farnell; Supplier Part Number 1: 1696060; RoHS: YES; Pricing 1: 5=0,79, 50=0,74, 100=0,67, 250=0,63, 750=0,58 (EUR); ComponentLink1URL: http://www.farnell.com/datasheets/1563530.igs; ComponentLink1Description: http://www.farnell.com/datasheets/1563530.igs; ComponentLink2URL: http://www.farnell.com/datasheets/1443095.pdf; ComponentLink2Description: http://www.farnell.com/datasheets/1443095.pdf; ComponentLink3URL: http://www.farnell.com/cad/1563578.stp; ComponentLink3Description: http://www.farnell.com/cad/1563578.stp
Q5 = 2N7002: N-channel Enhancement Mode Field-effect Transistor; Manufacturer: NXP; Published: 17-Sep-2003; LatestRevisionDate: 12-Dec-2006; LatestRevisionNote: IPC-7351 Footprint Added.; DatasheetVersion: 27-Jul-2000; PackageVersion: May-1999; PackageReference: SOT23; Publisher: Altium Limited; PackageDescription: 3-Pin SOT-23 Package 0.95 mm Pitch, 2.3 mm Lead Span; ComponentLink1Description: Manufacturer Link; ComponentLink1URL: http://www.semiconductors.philips.com/; ComponentLink2Description: Datasheet; ComponentLink2URL: http://www.semiconductors.philips.com/acrobat/datasheets/2N7002_4.pdf; Supplier 1: Farnell; Supplier Part Number 1: 1510761; Manufacturer Part Number: 2N7002; RoHS: YES; Stock 1: 14389; Pricing 1: 5=0,177, 25=0,118, 100=0,044, 1000=0,037, 3000=0,028 (EUR); ComponentLink3URL: http://www.nxp.com/documents/spice_model/2N7002.LIB; ComponentLink3Description: http://www.nxp.com/documents/spice_model/2N7002.LIB; ComponentLink4URL: http://beta.nxp.com/documents/data_sheet/2N7002PV.pdf; ComponentLink4Description: http://beta.nxp.com/documents/data_sheet/2N7002PV.pdf
R24 = Resistor 0805 680: Resistor
R35 R36 R62-R66 = Resistor 0805 0R: Resistor or Jumper; Manufacturer: MULTICOMP; Manufacturer Part Number: MCMR08X000 PTL; Product Range: MULTICOMP - MCMR Series; Résistance: 0; Puissance: 125; Tolérance de résistance: ± 0.05; Type de boîtier de résistance: 0805; Type de résistance: Céramique; Coefficient de température: -200ppm/°C à +400; Tension: 150; Type de packaging: Cut Tape; Resistor Mounting: CMS; Supplier 1: Farnell; Supplier Part Number 1: 2073603; RoHS: YES; Pricing 1: 100=0,011, 500=0,009, 1000=0,008 (EUR); MSL: MSL 1 - Illimité; ComponentLink1URL: http://www.farnell.com/datasheets/1716708.pdf; ComponentLink1Description: http://www.farnell.com/datasheets/1716708.pdf
R67-R73 = Resistor 0805 2.2K: Resistor; Manufacturer: MULTICOMP; Manufacturer Part Number: MC01W080512K2; Supplier 1: Farnell; RoHS: YES; Pricing 1: 5000=0,001 (EUR); ComponentLink1URL: http://www.farnell.com/datasheets/1729047.pdf; ComponentLink1Description: http://www.farnell.com/datasheets/1729047.pdf; Supplier Part Number 1: 2129138

## Sheet RS232.SchDoc: RS-232
size A4; Date: 30 08 2013; Author: Rachid AKKOUCHE; CompanyName: RASoftware; DrawnBy: Rachid AKKOUCHE; Address1: 52 J03 rue de la crèche; Address2: 77100 MEAUX; Address3: FRANCE; DocumentNumber: BRA201308305C; Revision: C; SheetNumber: 5; SheetTotal: 11; Telephone: +33651604047; Email: rachid.akkouche@wanadoo.fr; Proprietaire: MDI System; Dessinepar: -; Verifiepar: -; Time: 19:00
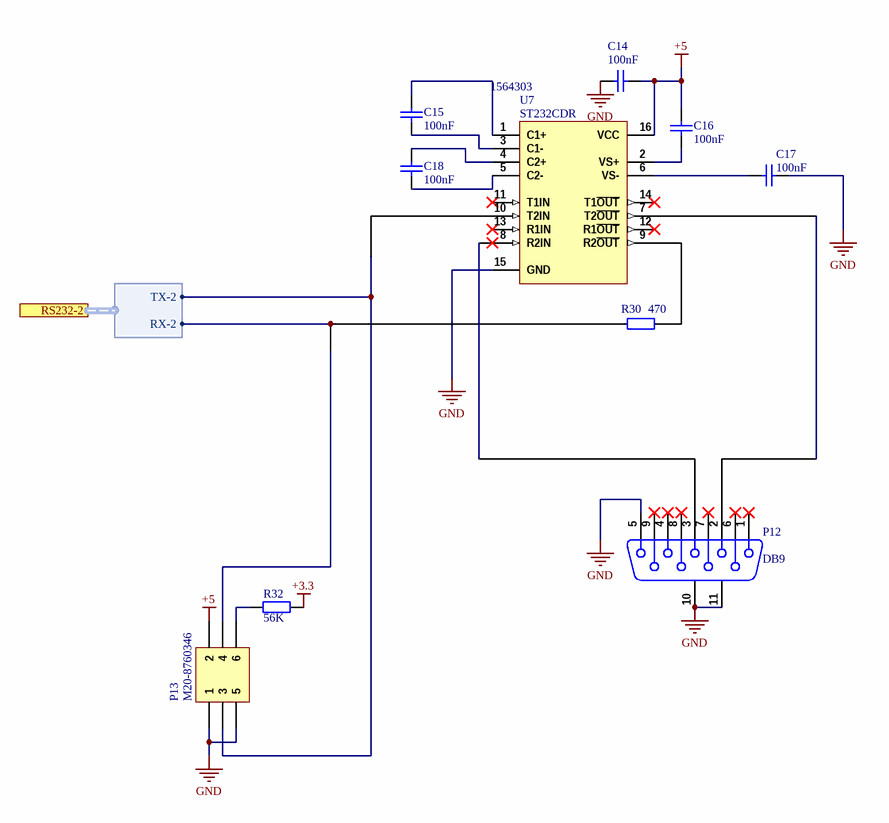
[diagram p7: RS232.SchDoc]

### Parts
C14  100nF  [C0805]  (no BOM)
C15  100nF  [C0805]  (no BOM)
C16  100nF  [C0805]  (no BOM)
C17  100nF  [C0805]  (no BOM)
C18  100nF  [C0805]  (no BOM)
P12  DB9  [SUBD9_F_V]  (no BOM)
P13  M20-8760346  [M20-2X3]  (no BOM)
R30  470  [R0805]  (no BOM)
R32  56K  [R0805]  (no BOM)
U7  ST232CDR  Supplier Part Number 1: 1564303  [SO-16]  (no BOM)

### Ports
RS232-2 (harness RS232_2)

### Harnesses
RS232_2: TX-2, RX-2

### Nets
+3.3: R32.2
+5: C14.1 C16.2 P13.2 U7.16(VCC)
GND: C14.2 C17.1 P12.5 P12.10(MH1) P12.11(MH2) P13.1 P13.5 U7.15(GND)
NetC15_1: C15.1 U7.3(C1-)
NetC15_2: C15.2 U7.1(C1+)
NetC16_1: C16.1 U7.2(VS+)
NetC17_2: C17.2 U7.6(VS-)
NetC18_1: C18.1 U7.5(C2-)
NetC18_2: C18.2 U7.4(C2+)
NetP12_2: P12.2 U7.7(T2~{OUT})
NetP12_3: P12.3 U7.8(R2IN)
NetP13_3: P13.3 U7.10(T2IN) ; port RS232-2.TX-2
NetP13_4: P13.4 R30.1 ; port RS232-2.RX-2
NetP13_6: P13.6 R32.1
NetR30_2: R30.2 U7.9(R2~{OUT})

Not connected (* = marked no-connect by the designer): P12 1* 4* 6* 7* 8* 9*; U7 11(T1IN)* 12(R1~{OUT})* 13(R1IN)* 14(T1~{OUT})*

### Notes on the sheet
- Ce document est la propriété de
- Project:
- Il ne peut être divulgué sans l'accord écrit de l'un de ses représentants dûment mandaté
- Title:
- Number:
- Date:
- Time:
- Size:
- A4
- Revision:
- Sheet
- of
- 52 J03 rue de la crèche
- Draw by:
- 77100 Meaux

### Library data of the parts
C14-C18 = Cap: Capacitor; Manufacturer: MULTICOMP; Manufacturer Part Number: MCCA000296; Supplier 1: Farnell; Supplier Part Number 1: 1759167; Stock 1: 225269; Pricing 1: 100=0,01, 500=0,008, 1000=0,006, 4000=0,005 (EUR); ComponentLink1URL: http://www.farnell.com/datasheets/1520827.pdf; ComponentLink1Description: http://www.farnell.com/datasheets/1520827.pdf
P12 = D Connector 9: Receptacle Assembly, 9 Position, Right Angle; Manufacturer: TE CONNECTIVITY / AMP; Manufacturer Part Number: 2-338313-2; Type de connecteur: Sub-D; Série: HDP-20; Genre: Embase; Nombre de contacts: 9; Nombre de rangées: 2; Plaquage du contact: Or; Matériau du contact: Bronze phosphoreux; Méthode de terminaison: A souder; Supplier 1: Farnell; Supplier Part Number 1: 1772804; RoHS: YES; Stock 1: 500; Pricing 1: 10=5,54, 50=5,31, 100=5,09, 250=4,63, 500=4,25 (EUR); ComponentLink1URL: http://www.tycoelectronics.com/commerce/DocumentDelivery/DDEController?Action=srchrtrv&DocNm=2-338313-2&DocType=Customer+View+Model&DocLang=English; ComponentLink1Description: http://www.tycoelectronics.com/commerce/DocumentDelivery/DDEController?Action=srchrtrv&DocNm=2-338313-2&DocType=Customer+View+Model&DocLang=English; ComponentLink2URL: http://www.farnell.com/cad/1599981.pdf; ComponentLink2Description: http://www.farnell.com/cad/1599981.pdf; ComponentLink3URL: http://www.farnell.com/datasheets/1643129.pdf; ComponentLink3Description: http://www.farnell.com/datasheets/1643129.pdf
P13 = Header 3X2: Header, 3-Pin, Dual row; Manufacturer: Harwin; Mounting Angle: Vertical; Pitch: 2.54 mm; Number of Positions / Contacts: 6; Supplier 1: Mouser; Supplier Part Number 1: 855-M20-8760346; Manufacturer Part Number: M20-8760346; RoHS: RoHS Compliant; Category: Headers & Wire Housings; Stock 1: 0; Pricing 1: 2250=0.285, 2500=0.213, 10000=0.211 (AUD); Contact Plating: Gold; Number of Rows: 2; Packaging: Bag; Series: M20-876; Termination Style: Solder; Mounting Style: SMD/SMT; Product Category: 2.54mm M20 SMT Connectors; Product Type: Headers - Pin Strip; Standard Pack Qty: 1000; RoHS - Mouser: Y; Minimum Order Quantity: 2250; Reeling: False; ComponentLink1URL: http://harwin.com/include/downloads/drawings/M20-876.PDF; ComponentLink1Description: http://harwin.com/include/downloads/drawings/M20-876.PDF
R30 = Res2: Resistor; Manufacturer: MULTICOMP; Manufacturer Part Number: MC0.1W08051%470RFR; Supplier 1: Farnell; Supplier Part Number 1: 2129087; RoHS: YES; Stock 1: 364995; Pricing 1: 5000=0,001 (EUR); ComponentLink1URL: http://www.farnell.com/datasheets/1636796.pdf; ComponentLink1Description: http://www.farnell.com/datasheets/1636796.pdf
R32 = Resistor 0805 56K: as R1 on sheet KEYBOARD; Supplier 1: Farnell; RoHS: YES; Pricing 1: 5000=0,001 (EUR); MSL: (Non Applicable); ComponentLink1URL: http://www.farnell.com/datasheets/1716700.pdf; ComponentLink1Description: http://www.farnell.com/datasheets/1716700.pdf; Supplier Part Number 1: 2129258
U7 = MAX232D: Dual EIA-232 Driver/Receiver; Manufacturer: STMICROELECTRONICS; Type de driver: Driver / Récepteur de ligne; Type d'interface CI: RS232; Nombre de drivers: 2; Tension, alimentation min.: 4.5; Tension, alimentation max..: 5.5; Type de boîtier CI Driver: SOIC; Nombre de broches: 16; Température d'utilisation min: 0; Température de fonctionnement max..: 70; SVHC: No SVHC (19-Dec-2012); Courant, alimentation: 5; Gamme de tension d'alimentation: 4.5V à 5.5; Interface: RS232, V.28; Racine de la référence: 232; Taux de transfert: 220; Technologie: Transceivers; Temps de propagation: 0.3; Température de fonctionnement: 0°C à +70; Type de terminaison: SMD; Supplier 1: Farnell; Manufacturer Part Number: ST232CDR; RoHS: YES; Stock 1: 7532; Pricing 1: 1=0,8, 10=0,75, 100=0,71, 250=0,61, 500=0,56 (EUR); MSL: MSL 1 - Illimité; Nombre de récepteurs: 2; Type de boîtier: SOIC; ComponentLink1URL: http://www.st.com/web/en/resource/technical/document/datasheet/CD00001703.pdf; ComponentLink1Description: http://www.st.com/web/en/resource/technical/document/datasheet/CD00001703.pdf; ComponentLink2URL: http://www.farnell.com/cad/1725166.zip; ComponentLink2Description: http://www.farnell.com/cad/1725166.zip